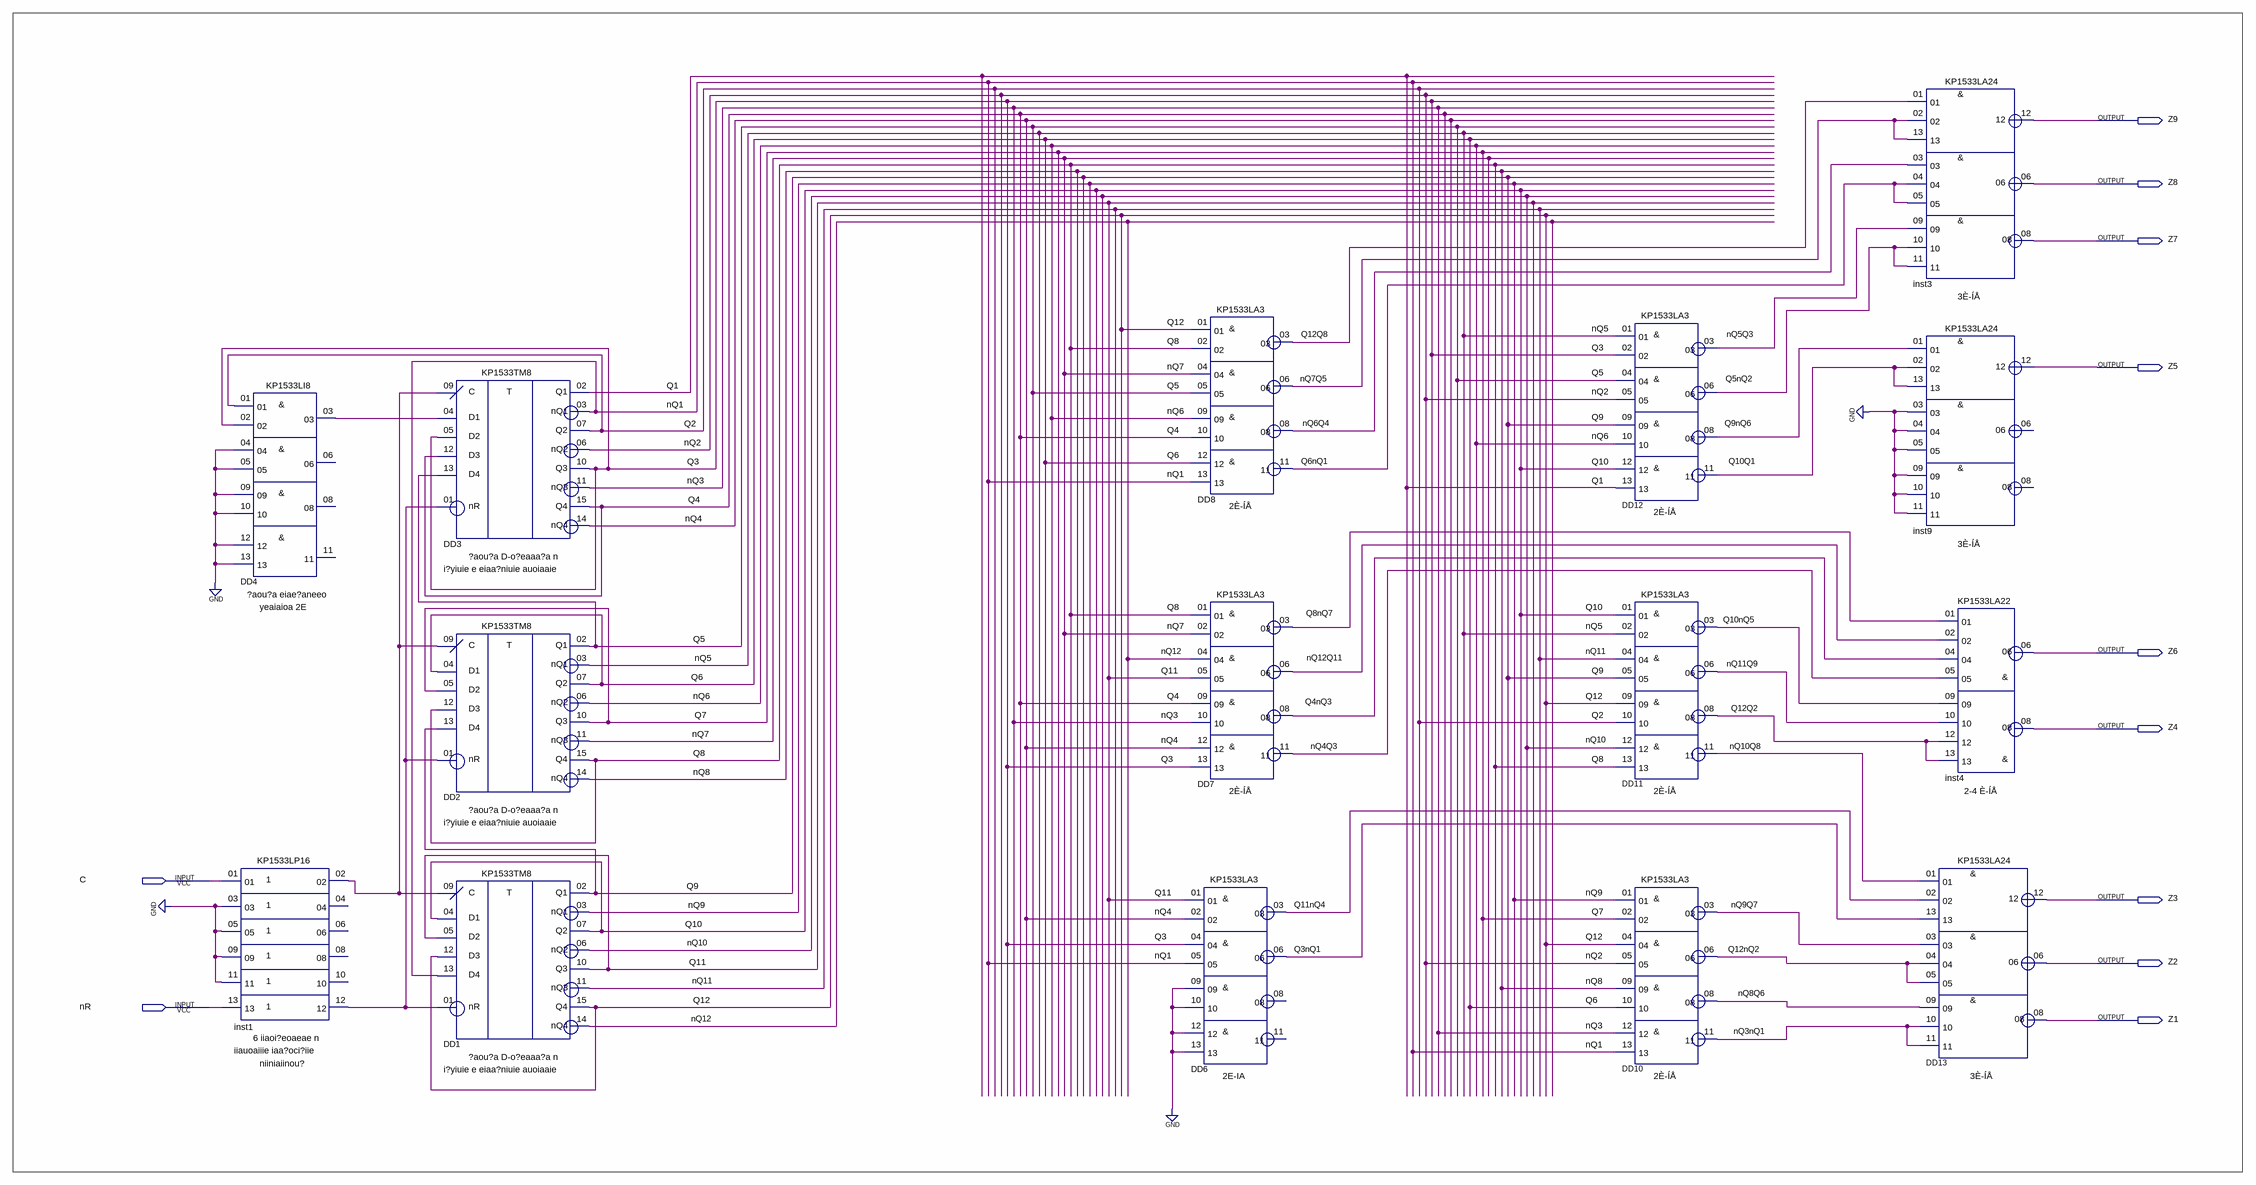
[diagram p0: schematic sheet]
// Quartus schematic _PK_NAND.bdf as structural Verilog: 15 symbols, 11 pins
module _PK_NAND (
  input  C,
  input  nR,
  output Z9,
  output Z8,
  output Z7,
  output Z5,
  output Z6,
  output Z4,
  output Z3,
  output Z2,
  output Z1
);

  wire DD4_03, inst1_02, inst1_12, nQ1, nQ2, nQ3, nQ3nQ1, nQ4, nQ4Q3, nQ5, nQ5Q3, nQ6, nQ6Q4, nQ7, nQ7Q5,
       nQ8, nQ8Q6, nQ9, nQ9Q7, nQ10, nQ10Q8, nQ11, nQ11Q9, nQ12, nQ12Q11, Q1, Q2, Q3, Q3nQ1, Q4, Q4nQ3, Q5,
       Q5nQ2, Q6, Q6nQ1, Q7, Q8, Q8nQ7, Q9, Q9nQ6, Q10, Q10nQ5, Q10Q1, Q11, Q11nQ4, Q12, Q12nQ2, Q12Q2, Q12Q8;

  KP1533LP16 inst1 (
    .\01 (C), .\03 (1'b0), .\05 (1'b0), .\09 (1'b0), .\11 (1'b0), .\13 (nR), .\02 (inst1_02), .\12 (inst1_12));  // open: 04, 06, 08, 10
  KP1533LI8 DD4 (
    .\01 (Q2), .\02 (Q3), .\04 (1'b0), .\05 (1'b0), .\09 (1'b0), .\10 (1'b0), .\12 (1'b0), .\13 (1'b0),
    .\03 (DD4_03));  // open: 06, 08, 11
  KP1533TM8 DD3 (
    .nR(inst1_12), .C(inst1_02), .D1(DD4_03), .D2(Q3), .D3(Q4), .D4(Q5), .Q1(Q1), .nQ1(nQ1), .Q2(Q2),
    .nQ2(nQ2), .Q3(Q3), .nQ3(nQ3), .Q4(Q4), .nQ4(nQ4));
  KP1533TM8 DD2 (
    .nR(inst1_12), .C(inst1_02), .D1(Q6), .D2(Q7), .D3(Q8), .D4(Q9), .Q1(Q5), .nQ1(nQ5), .Q2(Q6), .nQ2(nQ6),
    .Q3(Q7), .nQ3(nQ7), .Q4(Q8), .nQ4(nQ8));
  KP1533TM8 DD1 (
    .nR(inst1_12), .C(inst1_02), .D1(Q10), .D2(Q11), .D3(Q12), .D4(nQ1), .Q1(Q9), .nQ1(nQ9), .Q2(Q10),
    .nQ2(nQ10), .Q3(Q11), .nQ3(nQ11), .Q4(Q12), .nQ4(nQ12));
  KP1533LA3 DD6 (
    .\01 (Q11), .\02 (nQ4), .\04 (Q3), .\05 (nQ1), .\09 (1'b0), .\10 (1'b0), .\12 (1'b0), .\13 (1'b0),
    .\03 (Q11nQ4), .\06 (Q3nQ1));  // open: 08, 11
  KP1533LA3 DD8 (
    .\01 (Q12), .\02 (Q8), .\04 (nQ7), .\05 (Q5), .\09 (nQ6), .\10 (Q4), .\12 (Q6), .\13 (nQ1), .\03 (Q12Q8),
    .\06 (nQ7Q5), .\08 (nQ6Q4), .\11 (Q6nQ1));
  KP1533LA3 DD7 (
    .\01 (Q8), .\02 (nQ7), .\04 (nQ12), .\05 (Q11), .\09 (Q4), .\10 (nQ3), .\12 (nQ4), .\13 (Q3),
    .\03 (Q8nQ7), .\06 (nQ12Q11), .\08 (Q4nQ3), .\11 (nQ4Q3));
  KP1533LA3 DD12 (
    .\01 (nQ5), .\02 (Q3), .\04 (Q5), .\05 (nQ2), .\09 (Q9), .\10 (nQ6), .\12 (Q10), .\13 (Q1), .\03 (nQ5Q3),
    .\06 (Q5nQ2), .\08 (Q9nQ6), .\11 (Q10Q1));
  KP1533LA3 DD11 (
    .\01 (Q10), .\02 (nQ5), .\04 (nQ11), .\05 (Q9), .\09 (Q12), .\10 (Q2), .\12 (nQ10), .\13 (Q8),
    .\03 (Q10nQ5), .\06 (nQ11Q9), .\08 (Q12Q2), .\11 (nQ10Q8));
  KP1533LA3 DD10 (
    .\01 (nQ9), .\02 (Q7), .\04 (Q12), .\05 (nQ2), .\09 (nQ8), .\10 (Q6), .\12 (nQ3), .\13 (nQ1),
    .\03 (nQ9Q7), .\06 (Q12nQ2), .\08 (nQ8Q6), .\11 (nQ3nQ1));
  KP1533LA24 inst3 (
    .\01 (Q12Q8), .\02 (nQ7Q5), .\13 (nQ7Q5), .\03 (nQ6Q4), .\04 (Q6nQ1), .\05 (Q6nQ1), .\09 (nQ5Q3),
    .\10 (Q5nQ2), .\11 (Q5nQ2), .\12 (Z9), .\06 (Z8), .\08 (Z7));
  KP1533LA24 inst9 (
    .\01 (Q9nQ6), .\02 (Q10Q1), .\13 (Q10Q1), .\03 (1'b0), .\04 (1'b0), .\05 (1'b0), .\09 (1'b0),
    .\10 (1'b0), .\11 (1'b0), .\12 (Z5));  // open: 06, 08
  KP1533LA22 inst4 (
    .\01 (Q8nQ7), .\02 (nQ12Q11), .\04 (Q4nQ3), .\05 (nQ4Q3), .\09 (Q10nQ5), .\10 (nQ11Q9), .\12 (Q12Q2),
    .\13 (Q12Q2), .\06 (Z6), .\08 (Z4));
  KP1533LA24 DD13 (
    .\01 (nQ10Q8), .\02 (Q11nQ4), .\13 (Q3nQ1), .\03 (nQ9Q7), .\04 (Q12nQ2), .\05 (Q12nQ2), .\09 (nQ8Q6),
    .\10 (nQ3nQ1), .\11 (nQ3nQ1), .\12 (Z3), .\06 (Z2), .\08 (Z1));
endmodule
